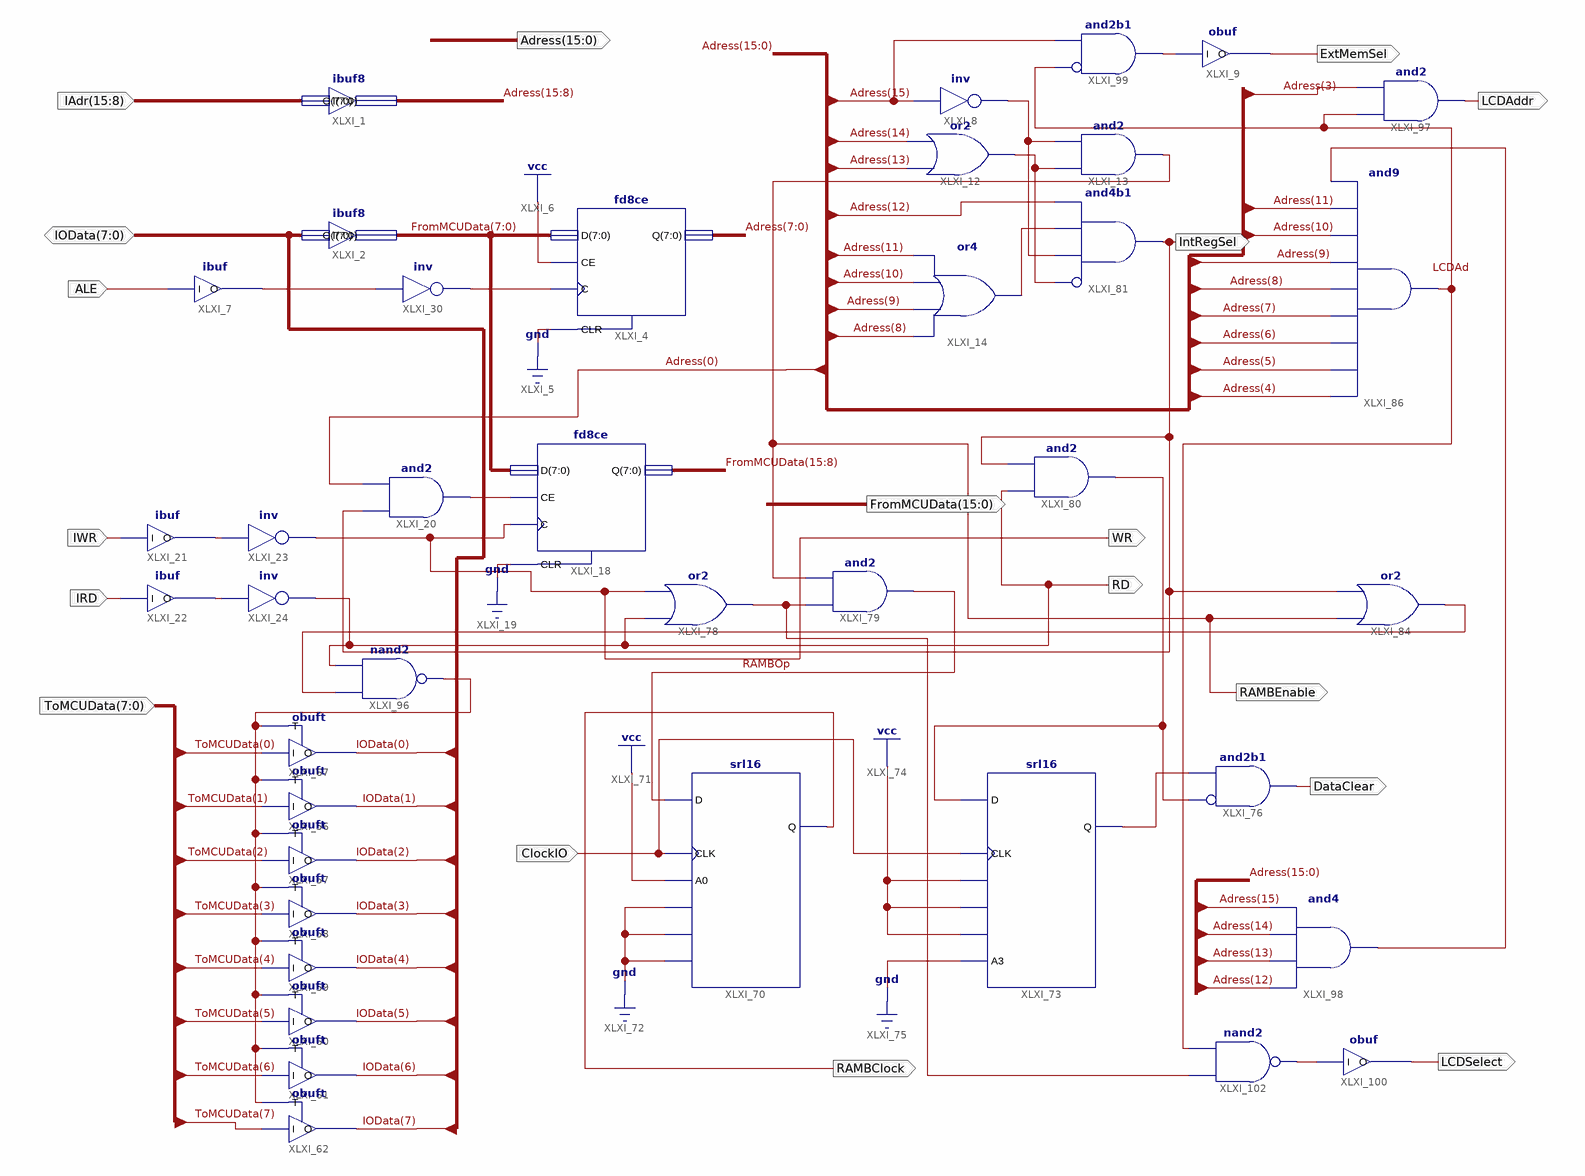
[diagram p0: schematic sheet 1]
// Xilinx ISE schematic Inteface_N_ST7565.sch (spartan6) as structural Verilog: 39 symbols, 18 ports
module Inteface_N_ST7565 (
  input  [15:8] IAdr,
  input  ALE,
  input  [7:0] ToMCUData,
  input  IWR,
  input  IRD,
  input  ClockIO,
  inout  [7:0] IOData,
  output [15:0] Adress,
  output ExtMemSel,
  output IntRegSel,
  output RAMBClock,
  output DataClear,
  output RAMBEnable,
  output WR,
  output [15:0] FromMCUData,
  output RD,
  output LCDAddr,
  output LCDSelect
);

  wire LCDAd, RAMBOp, ReadEnable, XLXN_18, XLXN_30, XLXN_41, XLXN_46, XLXN_47, XLXN_53, XLXN_54, XLXN_147,
       XLXN_157, XLXN_164, XLXN_170, XLXN_180, XLXN_212, XLXN_213, XLXN_219;

  ibuf8 XLXI_1 (.I(IAdr), .O(Adress[15:8]));
  ibuf8 XLXI_2 (.I(IOData), .O(FromMCUData[7:0]));
  not XLXI_8 (XLXN_170, Adress[15]);
  obuf XLXI_9 (.I(XLXN_213), .O(ExtMemSel));
  or XLXI_12 (XLXN_18, Adress[13], Adress[14]);
  and XLXI_13 (RAMBEnable, XLXN_18, XLXN_170);
  or XLXI_14 (XLXN_30, Adress[8], Adress[9], Adress[10], Adress[11]);
  fd8ce XLXI_4 (.C(XLXN_53), .CE(1'b1), .CLR(1'b0), .D(FromMCUData[7:0]), .Q(Adress[7:0]));
  fd8ce XLXI_18 (.C(WR), .CE(XLXN_41), .CLR(1'b0), .D(FromMCUData[7:0]), .Q(FromMCUData[15:8]));
  and XLXI_20 (XLXN_41, IntRegSel, Adress[0]);
  ibuf XLXI_7 (.I(ALE), .O(XLXN_54));
  not XLXI_30 (XLXN_53, XLXN_54);
  obuft XLXI_56 (.I(ToMCUData[1]), .T(ReadEnable), .O(IOData[1]));
  obuft XLXI_57 (.I(ToMCUData[2]), .T(ReadEnable), .O(IOData[2]));
  obuft XLXI_58 (.I(ToMCUData[3]), .T(ReadEnable), .O(IOData[3]));
  obuft XLXI_59 (.I(ToMCUData[4]), .T(ReadEnable), .O(IOData[4]));
  obuft XLXI_60 (.I(ToMCUData[5]), .T(ReadEnable), .O(IOData[5]));
  obuft XLXI_61 (.I(ToMCUData[6]), .T(ReadEnable), .O(IOData[6]));
  obuft XLXI_62 (.I(ToMCUData[7]), .T(ReadEnable), .O(IOData[7]));
  ibuf XLXI_21 (.I(IWR), .O(XLXN_46));
  ibuf XLXI_22 (.I(IRD), .O(XLXN_47));
  not XLXI_23 (WR, XLXN_46);
  not XLXI_24 (RD, XLXN_47);
  obuft XLXI_67 (.I(ToMCUData[0]), .T(ReadEnable), .O(IOData[0]));
  srl16 XLXI_70 (.A0(1'b1), .A1(1'b0), .A2(1'b0), .A3(1'b0), .CLK(ClockIO), .D(RAMBOp), .Q(RAMBClock));
  srl16 XLXI_73 (.A0(1'b1), .A1(1'b1), .A2(1'b1), .A3(1'b0), .CLK(ClockIO), .D(XLXN_164), .Q(XLXN_147));
  and XLXI_76 (DataClear, ~XLXN_164, XLXN_147);  // and2b1
  or XLXI_78 (XLXN_157, RD, WR);
  and XLXI_79 (RAMBOp, XLXN_157, RAMBEnable);
  and XLXI_80 (XLXN_164, RD, IntRegSel);
  and XLXI_81 (IntRegSel, ~XLXN_18, XLXN_170, XLXN_30, Adress[12]);  // and4b1
  or XLXI_84 (XLXN_180, RAMBEnable, IntRegSel);
  and XLXI_86 (LCDAd, Adress[4], Adress[5], Adress[6], Adress[7], Adress[8], Adress[9], Adress[10], Adress[11], XLXN_212);
  nand XLXI_96 (ReadEnable, XLXN_180, RD);
  and XLXI_97 (LCDAddr, LCDAd, Adress[3]);
  and XLXI_98 (XLXN_212, Adress[12], Adress[13], Adress[14], Adress[15]);
  and XLXI_99 (XLXN_213, ~LCDAd, Adress[15]);  // and2b1
  obuf XLXI_100 (.I(XLXN_219), .O(LCDSelect));
  nand XLXI_102 (XLXN_219, XLXN_157, LCDAd);
endmodule
